# Altium schematic sheet Power.SchDoc
size A4
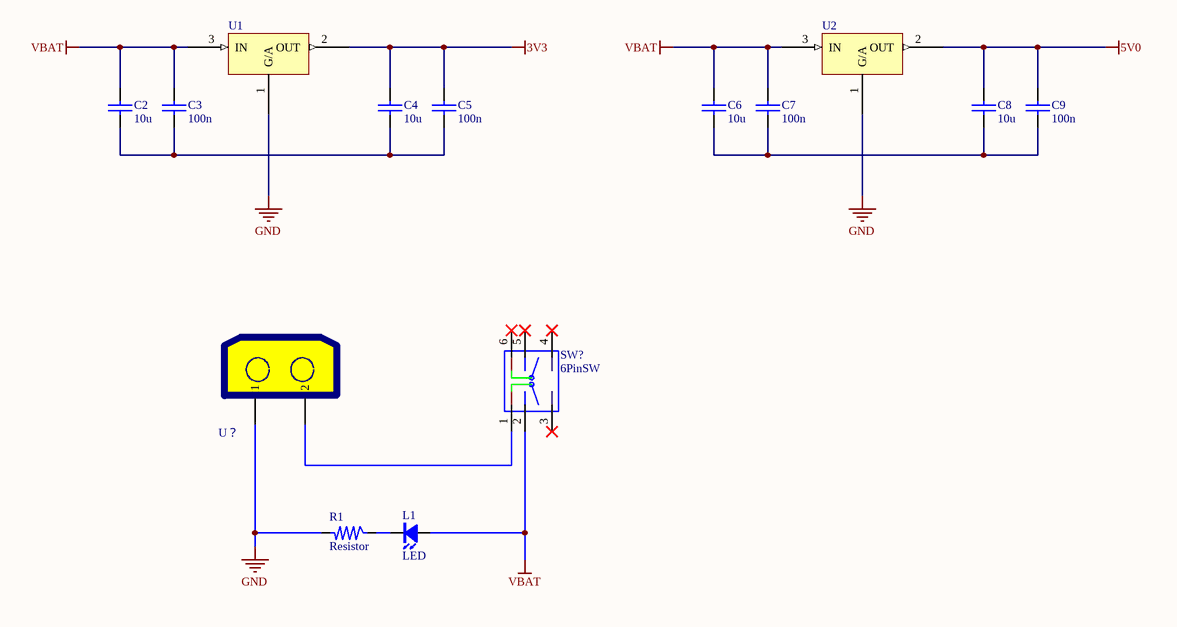
[diagram p0: Power.SchDoc]

## Parts
C2  10u  [C0805]
C3  100n  [C0603]
C4  10u  [C0805]
C5  100n  [C0603]
C6  10u  [C0805]
C7  100n  [C0603]
C8  10u  [C0805]
C9  100n  [C0603]
L1  LED  [LED0805TB]
R1  Resistor  [R0805]
SW?  6PinSW  [SW-7X7]
U1  AMS1117-XX  [SOT223]  (value not drawn)
U2  AMS1117-XX  [SOT223]  (value not drawn)
U？  P  [2脚接头]  (value not drawn)

## Nets
3V3: C4.1 C5.1 U1.2(OUT)
5V0: C8.1 C9.1 U2.2(OUT)
GND: R1.1 U1.1(G/A) U2.1(G/A) U？.1
VBAT: C2.1 C3.1 C6.1 C7.1 L1.1(A) SW?.2 U1.3(IN) U2.3(IN)
NetC2_2: C2.2 C3.2 C4.2 C5.2
NetC6_2: C6.2 C7.2 C8.2 C9.2
NetL1_2: L1.2(K) R1.2
NetSW?_1: SW?.1 U？.2

Not connected (* = marked no-connect by the designer): SW? 3(5)* 4(6)* 5(7)* 6(8)*

## Notes on the sheet
- Title
- Size:
- Date:
- A4
- Number:
- Time:
- Revision:
- Sheet
- of
- File:

## Library data of the parts
C2-C9 = Capacitor: 电容
R1 = Resistor: 电阻
U1 U2 = AMS1117-XX: 稳压芯片
U？ = 2脚接头